# Altium schematic sheet Calc_Schem.SchDoc
size A; SheetNumber: 1; SheetTotal: 2
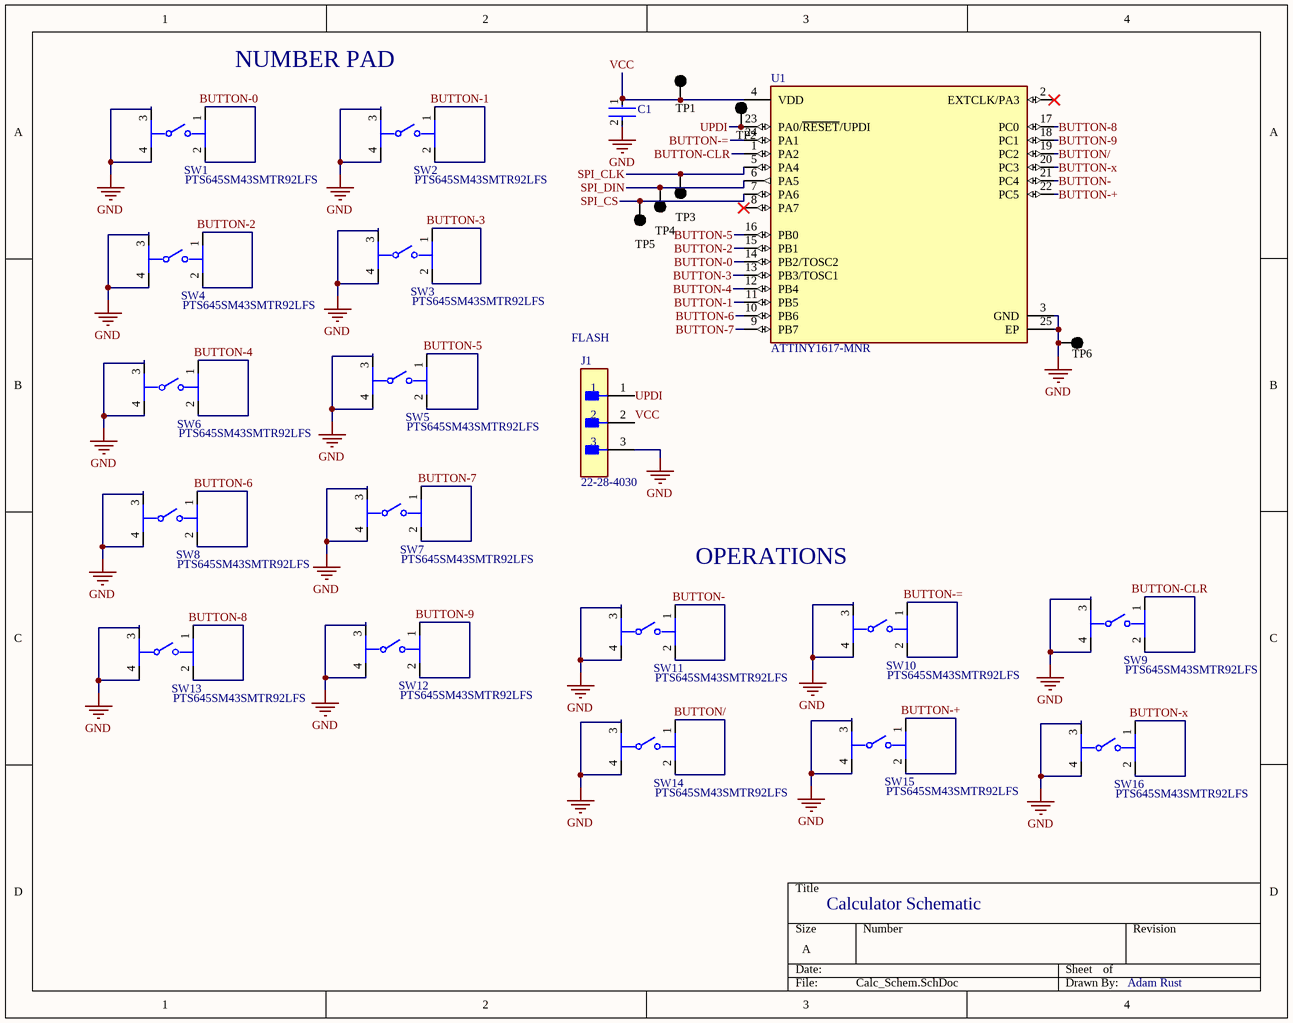
[diagram p0: Calc_Schem.SchDoc]

## Parts
C1  GRM155R71C104KA88D  [FP-GRM15-MFG]  (value not drawn)
J1  22-28-4030  [FP-22-28-4030-MFG]
SW1  PTS645SM43SMTR92LFS  [FP-PTS645SM43SMTR92LFS-MFG]
SW2  PTS645SM43SMTR92LFS  [FP-PTS645SM43SMTR92LFS-MFG]
SW3  PTS645SM43SMTR92LFS  [FP-PTS645SM43SMTR92LFS-MFG]
SW4  PTS645SM43SMTR92LFS  [FP-PTS645SM43SMTR92LFS-MFG]
SW5  PTS645SM43SMTR92LFS  [FP-PTS645SM43SMTR92LFS-MFG]
SW6  PTS645SM43SMTR92LFS  [FP-PTS645SM43SMTR92LFS-MFG]
SW7  PTS645SM43SMTR92LFS  [FP-PTS645SM43SMTR92LFS-MFG]
SW8  PTS645SM43SMTR92LFS  [FP-PTS645SM43SMTR92LFS-MFG]
SW9  PTS645SM43SMTR92LFS  [FP-PTS645SM43SMTR92LFS-MFG]
SW10  PTS645SM43SMTR92LFS  [FP-PTS645SM43SMTR92LFS-MFG]
SW11  PTS645SM43SMTR92LFS  [FP-PTS645SM43SMTR92LFS-MFG]
SW12  PTS645SM43SMTR92LFS  [FP-PTS645SM43SMTR92LFS-MFG]
SW13  PTS645SM43SMTR92LFS  [FP-PTS645SM43SMTR92LFS-MFG]
SW14  PTS645SM43SMTR92LFS  [FP-PTS645SM43SMTR92LFS-MFG]
SW15  PTS645SM43SMTR92LFS  [FP-PTS645SM43SMTR92LFS-MFG]
SW16  PTS645SM43SMTR92LFS  [FP-PTS645SM43SMTR92LFS-MFG]
TP1  BTN  [KSTN-5011_V]  (value not drawn)
TP2  BTN  [KSTN-5011_V]  (value not drawn)
TP3  BTN  [KSTN-5011_V]  (value not drawn)
TP4  BTN  [KSTN-5011_V]  (value not drawn)
TP5  BTN  [KSTN-5011_V]  (value not drawn)
TP6  BTN  [KSTN-5011_V]  (value not drawn)
U1  ATTINY1617-MNR  [FP-C04-21386-IPC_A]

## Nets
GND: C1.2 J1.3 SW1.3 SW1.4 SW2.3 SW2.4 SW3.3 SW3.4 SW4.3 SW4.4 SW5.3 SW5.4 SW6.3 SW6.4 SW7.3 SW7.4 SW8.3 SW8.4 SW9.3 SW9.4 SW10.3 SW10.4 SW11.3 SW11.4 SW12.3 SW12.4 SW13.3 SW13.4 SW14.3 SW14.4 SW15.3 SW15.4 SW16.3 SW16.4 TP6.1 U1.3(GND) U1.25(EP)
BUTTON-: SW11.1 SW11.2 U1.21(PC4)
BUTTON-0: SW1.1 SW1.2 U1.14(PB2/TOSC2)
BUTTON-1: SW2.1 SW2.2 U1.11(PB5)
BUTTON-2: SW4.1 SW4.2 U1.15(PB1)
BUTTON-3: SW3.1 SW3.2 U1.13(PB3/TOSC1)
BUTTON-4: SW6.1 SW6.2 U1.12(PB4)
BUTTON-5: SW5.1 SW5.2 U1.16(PB0)
BUTTON-6: SW8.1 SW8.2 U1.10(PB6)
BUTTON-7: SW7.1 SW7.2 U1.9(PB7)
BUTTON-8: SW13.1 SW13.2 U1.17(PC0)
BUTTON-9: SW12.1 SW12.2 U1.18(PC1)
BUTTON-+: SW15.1 SW15.2 U1.22(PC5)
BUTTON-=: SW10.1 SW10.2 U1.24(PA1)
BUTTON-CLR: SW9.1 SW9.2 U1.1(PA2)
BUTTON-x: SW16.1 SW16.2 U1.20(PC3)
BUTTON/: SW14.1 SW14.2 U1.19(PC2)
SPI_CLK: TP3.1 U1.5(PA4)
SPI_CS: TP5.1 U1.7(PA6)
SPI_DIN: TP4.1 U1.6(PA5)
UPDI: J1.1 TP2.1 U1.23(PA0/~{RESET}/UPDI)
VCC: C1.1 J1.2 TP1.1 U1.4(VDD)

Not connected (* = marked no-connect by the designer): U1 2(EXTCLK/PA3)* 8(PA7)*

## Notes on the sheet
- NUMBER PAD
- (near J1) FLASH
- OPERATIONS
- Calculator Schematic
- Adam Rust

## Library data of the parts
C1 = CMP-2100-03641-2: CAP CER 0.1UF 16V X7R 0402; Manufacturer: Murata; Standoff Height: 0mm; Tolerance: 10%; Voltage Rating: 16Vdc; Material: Ceramic; Capacitance: 0.10μF; Value: 0.10μF; RoHS: TRUE; Manufacturer Part Number: GRM155R71C104KA88D; Temperature Characteristic: X7R; Octopart: https://octopart.com/grm155r71c104ka88d-murata-196880; Digikey Description: CAP CER 0.1UF 16V X7R 0402; Device Class L3: Ceramic Capacitors; Height: 0.55mm; ComponentLink2Description: Datasheet; Temperature Range Low: -55°C; Ipc Land Pattern Name: CAPC10050X219; ComponentLink2URL: https://search.murata.co.jp/Ceramy/image/img/A01X/G101/ENG/GRM155R71H471KA01-01A.pdf; Device Class L1: Passive Components; Lead Free: yes; Category: Cap; Package: GRM15; Temperature: -55°C to +125°C; Device Class L2: Capacitors; Temperature Range High: +125°C; Mouser Description: 0402 0.1 uF 16V ±10 % Tolerance X7R SMT Multilayer Ceramic Capacitor
J1 = CMP-04776-000098-1: UPDI PROG; Manufacturer: Molex; Conn Orientation: Vertical; Conn Gender: Male; Current Rating: 4A; Pitch: 2.54mm; Voltage Rating: 500V; Number Of Contacts: 3; Category: Conn; Number Of Rows: 1; Manufacturer Part Number: 22-28-4030; RoHS: TRUE; Package: 22-28-4030; Footprint Url: https://www.molex.com/pdm_docs/sd/022284030_sd.pdf; ComponentLink2Description: Datasheet; Device Class L2: Headers and Wire Housings; Automotive: No; Temperature Range Low: -40°C; Digikey Description: CONN HEADER VERT 3POS 2.54MM; Mouser Description: Headers & Wire Housings 3P VERT HEADER Sn; Contact Material: Gold,Nickel; Device Class L1: Connectors; Lead Free: Yes; Device Class L3: unset; Temperature Range High: +80°C; Octopart: https://octopart.com/0022284030-molex-10476094; ComponentLink2URL: https://www.molex.com/webdocs/datasheets/pdf/en-us/0022284030_PCB_HEADERS.pdf; Height: 8.88mm; Temperature: -40°C to +80°C
SW1-SW16 = CMP-2000-05160-2: SWITCH TACTILE SPST-NO 0.05A 12V; Contact Resistance: 100mR; Throw Configuration: SPST; Illumination Type: Non-Illuminated; Mechanical Life: 100000Cycles; Current Rating: 50mA; Switch Function: Off-Mom; Actuator Length: 0.85mm; Actuator Material: Nylon; Actuator Type: Standard; Operating Force: 160gf; Min Operating Temperature: -20°C; REACH SVHC: No SVHC; Termination: Gull Wing; Case/Package: SMD/SMT; Packaging: Tape and Reel; Mount: Surface Mount; Voltage Rating (DC): 12V; Orientation: Straight; Lead Free: Lead Free; Contact Material: Silver; Color: Black; Max Current Rating: 50mA; Contact Plating: Silver; Depth: 9mm; Package Quantity: 1; Max Voltage Rating (DC): 12V; Length: 6mm; Max Operating Temperature: 60°C
TP1-TP6 = CMP-1672-00003-4: Test Point, Black, Through Hole, RoHS, Bulk; Manufacturer: Keystone; ComponentLink2URL: http://www.keyelco.com/product-pdf.cfm?p=1320; Colour: Black; Pins: 1; REACH SVHC: No SVHC; ComponentLink1URL: http://www.keyelco.com/; PackageReference: 5011; Contact Plating: Silver; Package Quantity: 100; Packaging: Bulk; RoHSCompliant: true; Height: 8.12 mm; PackageDescription: 1-Pin Through Hole Device, Dia 3.17 mm; Mount: Through Hole; Mounting Technology: Through Hole; DatasheetVersion: Rev. F, 12/2013; ComponentLink1Description: Manufacturer URL; Contact Material: Bronze; ComponentLink2Description: Datasheet
U1 = CMP-06276-000207-1: IC MCU 8BIT 16KB FLASH 24VQFN; Frequency: 20MHz; Core Architecture: AVR; Number of I/Os: 22; Oscillator Type: Internal; Interface: I2C; Peripherals: Brown-out Detect/Reset; Memory Type: FLASH; Packaging: Tape and Reel; Memory Size: 16KB; RoHS Compliant: Yes; Max Operating Temperature: 105°C; Case/Package: VQFN; Min Operating Temperature: -40°C